# EAGLE design trig3_board_de0-nano (EAGLE 9.6.2)
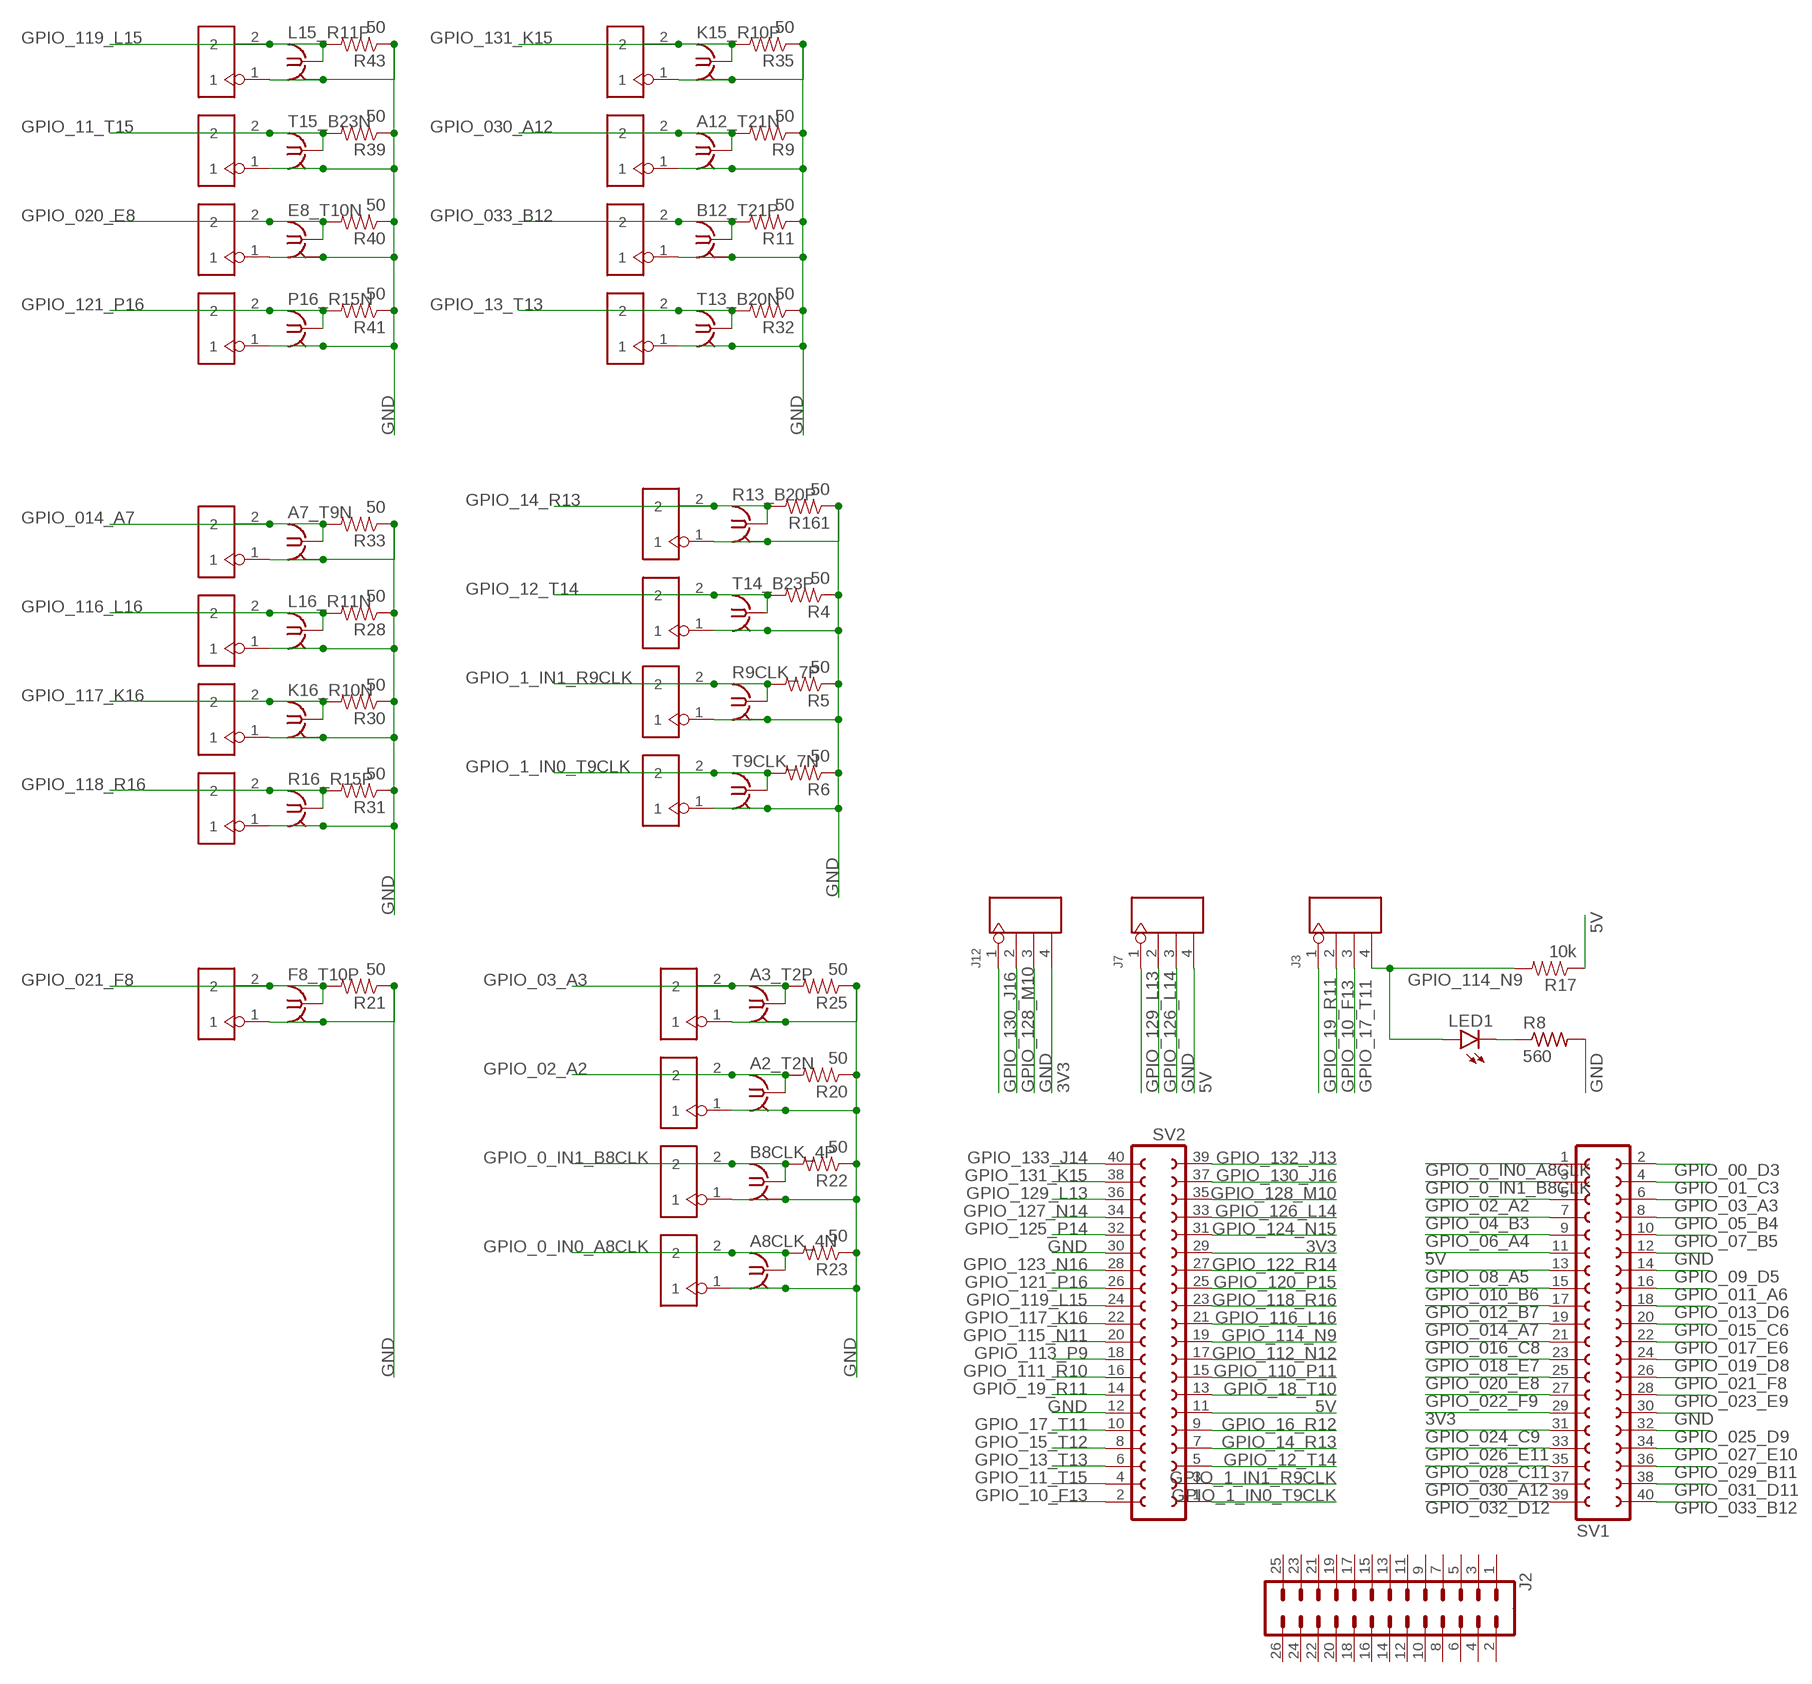
[diagram p0: schematic, sheet 1, part 1 of 2]
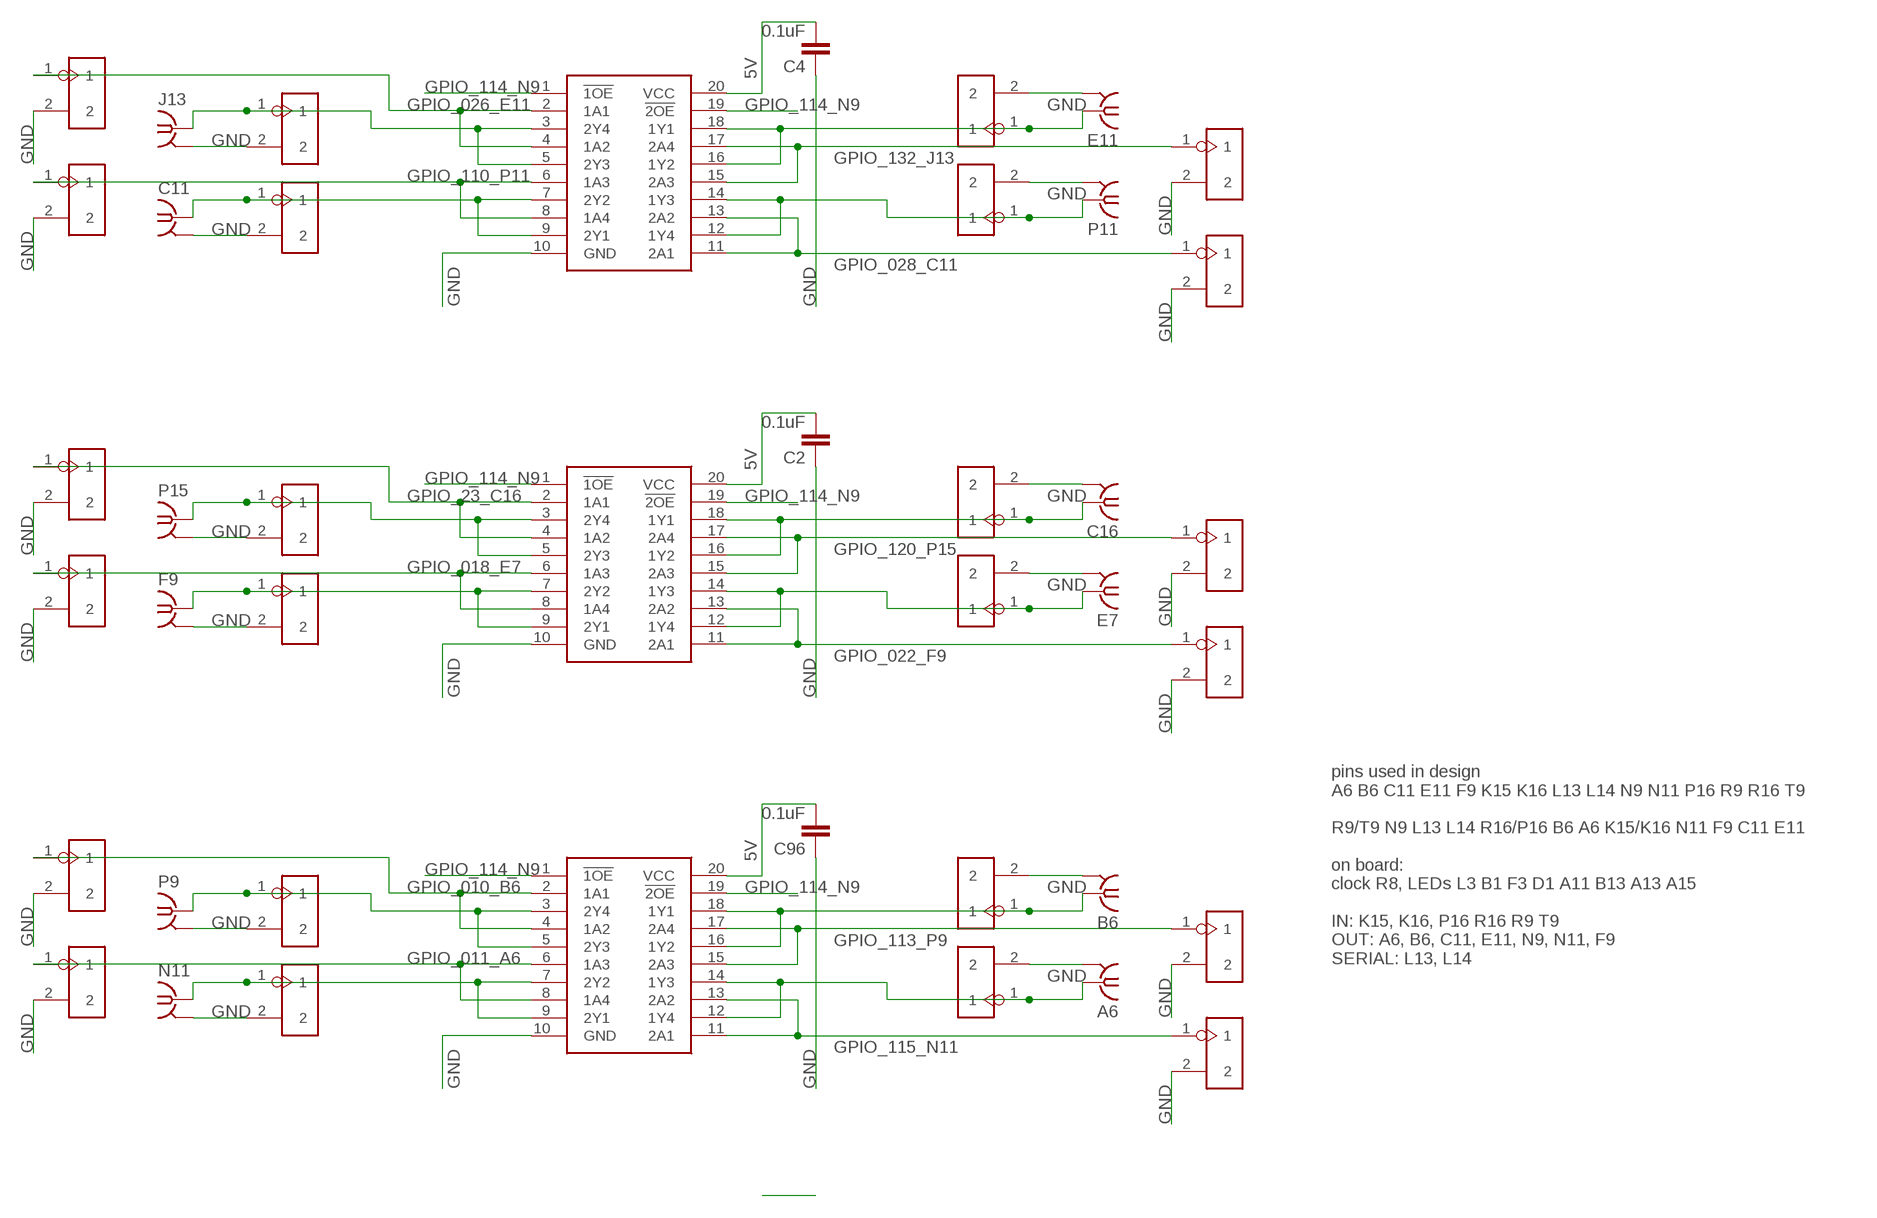
[diagram p1: schematic, sheet 1, part 2 of 2]

## Parts
A2_T2N  BU-SMB-V  [BU-SMB-V]
A3_T2P  BU-SMB-V  [BU-SMB-V]
A6  BU-SMB-V  [BU-SMB-V]
A7_T9N  BU-SMB-V  [BU-SMB-V]
A8CLK_4N  BU-SMB-V  [BU-SMB-V]
A12_T21N  BU-SMB-V  [BU-SMB-V]
B6  BU-SMB-V  [BU-SMB-V]
B8CLK_4P  BU-SMB-V  [BU-SMB-V]
B12_T21P  BU-SMB-V  [BU-SMB-V]
C2  0.1uF  CAP0805  [0805]
C4  0.1uF  CAP0805  [0805]
C11  BU-SMB-V  [BU-SMB-V]
C16  BU-SMB-V  [BU-SMB-V]
C96  0.1uF  CAP0805  [0805]
E7  BU-SMB-V  [BU-SMB-V]
E8_T10N  BU-SMB-V  [BU-SMB-V]
E11  BU-SMB-V  [BU-SMB-V]
F8_T10P  BU-SMB-V  [BU-SMB-V]
F9  BU-SMB-V  [BU-SMB-V]
J2  M13X22X13  [2X13]
J3  4p-2.54  DIP-BLACK-FEMALE-HEADER-VERT(4P-2.54)  [H4-2.54]
J4  2p-2.54  DIP-BLACK-MALE-HEADER-VERT(2P-2.54)  [H2-2.54]
J5  2p-2.54  DIP-BLACK-MALE-HEADER-VERT(2P-2.54)  [H2-2.54]
J6  2p-2.54  DIP-BLACK-MALE-HEADER-VERT(2P-2.54)  [H2-2.54]
J7  4p-2.54  DIP-BLACK-FEMALE-HEADER-VERT(4P-2.54)  [H4-2.54]
J12  4p-2.54  DIP-BLACK-FEMALE-HEADER-VERT(4P-2.54)  [H4-2.54]
J13  BU-SMB-V  [BU-SMB-V]
J17  2p-2.54  DIP-BLACK-MALE-HEADER-VERT(2P-2.54)  [H2-2.54]
J18  2p-2.54  DIP-BLACK-MALE-HEADER-VERT(2P-2.54)  [H2-2.54]
J22  2p-2.54  DIP-BLACK-MALE-HEADER-VERT(2P-2.54)  [H2-2.54]
J23  2p-2.54  DIP-BLACK-MALE-HEADER-VERT(2P-2.54)  [H2-2.54]
J24  2p-2.54  DIP-BLACK-MALE-HEADER-VERT(2P-2.54)  [H2-2.54]
J25  2p-2.54  DIP-BLACK-MALE-HEADER-VERT(2P-2.54)  [H2-2.54]
J32  2p-2.54  DIP-BLACK-MALE-HEADER-VERT(2P-2.54)  [H2-2.54]
J33  2p-2.54  DIP-BLACK-MALE-HEADER-VERT(2P-2.54)  [H2-2.54]
J34  2p-2.54  DIP-BLACK-MALE-HEADER-VERT(2P-2.54)  [H2-2.54]
J35  2p-2.54  DIP-BLACK-MALE-HEADER-VERT(2P-2.54)  [H2-2.54]
J36  2p-2.54  DIP-BLACK-MALE-HEADER-VERT(2P-2.54)  [H2-2.54]
J37  2p-2.54  DIP-BLACK-MALE-HEADER-VERT(2P-2.54)  [H2-2.54]
J38  2p-2.54  DIP-BLACK-MALE-HEADER-VERT(2P-2.54)  [H2-2.54]
J39  2p-2.54  DIP-BLACK-MALE-HEADER-VERT(2P-2.54)  [H2-2.54]
J40  2p-2.54  DIP-BLACK-MALE-HEADER-VERT(2P-2.54)  [H2-2.54]
J41  2p-2.54  DIP-BLACK-MALE-HEADER-VERT(2P-2.54)  [H2-2.54]
J42  2p-2.54  DIP-BLACK-MALE-HEADER-VERT(2P-2.54)  [H2-2.54]
J43  2p-2.54  DIP-BLACK-MALE-HEADER-VERT(2P-2.54)  [H2-2.54]
K15_R10P  BU-SMB-V  [BU-SMB-V]
K16_R10N  BU-SMB-V  [BU-SMB-V]
L15_R11P  BU-SMB-V  [BU-SMB-V]
L16_R11N  BU-SMB-V  [BU-SMB-V]
LED1  red  LEDCHIP-LED0805  [CHIP-LED0805]
N11  BU-SMB-V  [BU-SMB-V]
OJ41  2p-2.54  DIP-BLACK-MALE-HEADER-VERT(2P-2.54)  [H2-2.54]
OJ42  2p-2.54  DIP-BLACK-MALE-HEADER-VERT(2P-2.54)  [H2-2.54]
OJ43  2p-2.54  DIP-BLACK-MALE-HEADER-VERT(2P-2.54)  [H2-2.54]
OJ44  2p-2.54  DIP-BLACK-MALE-HEADER-VERT(2P-2.54)  [H2-2.54]
OJ45  2p-2.54  DIP-BLACK-MALE-HEADER-VERT(2P-2.54)  [H2-2.54]
OJ46  2p-2.54  DIP-BLACK-MALE-HEADER-VERT(2P-2.54)  [H2-2.54]
OJ47  2p-2.54  DIP-BLACK-MALE-HEADER-VERT(2P-2.54)  [H2-2.54]
OJ48  2p-2.54  DIP-BLACK-MALE-HEADER-VERT(2P-2.54)  [H2-2.54]
OJ57  2p-2.54  DIP-BLACK-MALE-HEADER-VERT(2P-2.54)  [H2-2.54]
OJ58  2p-2.54  DIP-BLACK-MALE-HEADER-VERT(2P-2.54)  [H2-2.54]
OJ59  2p-2.54  DIP-BLACK-MALE-HEADER-VERT(2P-2.54)  [H2-2.54]
OJ60  2p-2.54  DIP-BLACK-MALE-HEADER-VERT(2P-2.54)  [H2-2.54]
OJ61  2p-2.54  DIP-BLACK-MALE-HEADER-VERT(2P-2.54)  [H2-2.54]
OJ62  2p-2.54  DIP-BLACK-MALE-HEADER-VERT(2P-2.54)  [H2-2.54]
OJ63  2p-2.54  DIP-BLACK-MALE-HEADER-VERT(2P-2.54)  [H2-2.54]
OJ64  2p-2.54  DIP-BLACK-MALE-HEADER-VERT(2P-2.54)  [H2-2.54]
OJ73  2p-2.54  DIP-BLACK-MALE-HEADER-VERT(2P-2.54)  [H2-2.54]
OJ74  2p-2.54  DIP-BLACK-MALE-HEADER-VERT(2P-2.54)  [H2-2.54]
OJ75  2p-2.54  DIP-BLACK-MALE-HEADER-VERT(2P-2.54)  [H2-2.54]
OJ76  2p-2.54  DIP-BLACK-MALE-HEADER-VERT(2P-2.54)  [H2-2.54]
OJ77  2p-2.54  DIP-BLACK-MALE-HEADER-VERT(2P-2.54)  [H2-2.54]
OJ78  2p-2.54  DIP-BLACK-MALE-HEADER-VERT(2P-2.54)  [H2-2.54]
OJ79  2p-2.54  DIP-BLACK-MALE-HEADER-VERT(2P-2.54)  [H2-2.54]
OJ80  2p-2.54  DIP-BLACK-MALE-HEADER-VERT(2P-2.54)  [H2-2.54]
P9  BU-SMB-V  [BU-SMB-V]
P11  BU-SMB-V  [BU-SMB-V]
P15  BU-SMB-V  [BU-SMB-V]
P16_R15N  BU-SMB-V  [BU-SMB-V]
R4  50  RESISTORAXIAL-0.3  [AXIAL-0.3]
R5  50  RESISTORAXIAL-0.3  [AXIAL-0.3]
R6  50  RESISTORAXIAL-0.3  [AXIAL-0.3]
R8  560  R-US_R0805  [R0805]
R9  50  RESISTORAXIAL-0.3  [AXIAL-0.3]
R9CLK_7P  BU-SMB-V  [BU-SMB-V]
R11  50  RESISTORAXIAL-0.3  [AXIAL-0.3]
R13_B20P  BU-SMB-V  [BU-SMB-V]
R16_R15P  BU-SMB-V  [BU-SMB-V]
R17  10k  RESISTORAXIAL-0.3  [AXIAL-0.3]
R20  50  RESISTORAXIAL-0.3  [AXIAL-0.3]
R21  50  RESISTORAXIAL-0.3  [AXIAL-0.3]
R22  50  RESISTORAXIAL-0.3  [AXIAL-0.3]
R23  50  RESISTORAXIAL-0.3  [AXIAL-0.3]
R25  50  RESISTORAXIAL-0.3  [AXIAL-0.3]
R28  50  RESISTORAXIAL-0.3  [AXIAL-0.3]
R30  50  RESISTORAXIAL-0.3  [AXIAL-0.3]
R31  50  RESISTORAXIAL-0.3  [AXIAL-0.3]
R32  50  RESISTORAXIAL-0.3  [AXIAL-0.3]
R33  50  RESISTORAXIAL-0.3  [AXIAL-0.3]
R35  50  RESISTORAXIAL-0.3  [AXIAL-0.3]
R39  50  RESISTORAXIAL-0.3  [AXIAL-0.3]
R40  50  RESISTORAXIAL-0.3  [AXIAL-0.3]
R41  50  RESISTORAXIAL-0.3  [AXIAL-0.3]
R43  50  RESISTORAXIAL-0.3  [AXIAL-0.3]
R161  50  RESISTORAXIAL-0.3  [AXIAL-0.3]
SV1  FE20-2  [FE20-2]
SV2  FE20-2  [FE20-2]
T9CLK_7N  BU-SMB-V  [BU-SMB-V]
T13_B20N  BU-SMB-V  [BU-SMB-V]
T14_B23P  BU-SMB-V  [BU-SMB-V]
T15_B23N  BU-SMB-V  [BU-SMB-V]
VSLUE5  SN74ACT244DW  [SOIC127P1030X265-20N]
VSLUE7  SN74ACT244DW  [SOIC127P1030X265-20N]
VSLUE9  SN74ACT244DW  [SOIC127P1030X265-20N]

## Nets
3V3 [power]: J12.4 SV1.29 SV2.29
5V [power]: C2.2 C4.2 C96.2 J7.4 R17.P$1 SV1.11 SV2.11 VSLUE5.20(VCC) VSLUE7.20(VCC) VSLUE9.20(VCC)
GND: A2_T2N.2 A2_T2N.3 A2_T2N.4 A2_T2N.5 A3_T2P.2 A3_T2P.3 A3_T2P.4 A3_T2P.5 A6.2 A6.3 A6.4 A6.5 A7_T9N.2 A7_T9N.3 A7_T9N.4 A7_T9N.5 A8CLK_4N.2 A8CLK_4N.3 A8CLK_4N.4 A8CLK_4N.5 A12_T21N.2 A12_T21N.3 A12_T21N.4 A12_T21N.5 B6.2 B6.3 B6.4 B6.5 B8CLK_4P.2 B8CLK_4P.3 B8CLK_4P.4 B8CLK_4P.5 B12_T21P.2 B12_T21P.3 B12_T21P.4 B12_T21P.5 C2.1 C4.1 C11.2 C11.3 C11.4 C11.5 C16.2 C16.3 C16.4 C16.5 C96.1 E7.2 E7.3 E7.4 E7.5 E8_T10N.2 E8_T10N.3 E8_T10N.4 E8_T10N.5 E11.2 E11.3 E11.4 E11.5 F8_T10P.2 F8_T10P.3 F8_T10P.4 F8_T10P.5 F9.2 F9.3 F9.4 F9.5 J4.1 J5.1 J6.1 J7.3 J12.3 J13.2 J13.3 J13.4 J13.5 J17.1 J18.1 J22.1 J23.1 J24.1 J25.1 J32.1 J33.1 J34.1 J35.1 J36.1 J37.1 J38.1 J39.1 J40.1 J41.1 J42.1 J43.1 K15_R10P.2 K15_R10P.3 K15_R10P.4 K15_R10P.5 K16_R10N.2 K16_R10N.3 K16_R10N.4 K16_R10N.5 L15_R11P.2 L15_R11P.3 L15_R11P.4 L15_R11P.5 L16_R11N.2 L16_R11N.3 L16_R11N.4 L16_R11N.5 N11.2 N11.3 N11.4 N11.5 OJ41.2 OJ42.2 OJ43.2 OJ44.2 OJ45.2 OJ46.2 OJ47.2 OJ48.2 OJ57.2 OJ58.2 OJ59.2 OJ60.2 OJ61.2 OJ62.2 OJ63.2 OJ64.2 OJ73.2 OJ74.2 OJ75.2 OJ76.2 OJ77.2 OJ78.2 OJ79.2 OJ80.2 P9.2 P9.3 P9.4 P9.5 P11.2 P11.3 P11.4 P11.5 P15.2 P15.3 P15.4 P15.5 P16_R15N.2 P16_R15N.3 P16_R15N.4 P16_R15N.5 R4.P$1 R5.P$1 R6.P$1 R8.2 R9.P$1 R9CLK_7P.2 R9CLK_7P.3 R9CLK_7P.4 R9CLK_7P.5 R11.P$1 R13_B20P.2 R13_B20P.3 R13_B20P.4 R13_B20P.5 R16_R15P.2 R16_R15P.3 R16_R15P.4 R16_R15P.5 R20.P$1 R21.P$1 R22.P$1 R23.P$1 R25.P$1 R28.P$1 R30.P$1 R31.P$1 R32.P$1 R33.P$1 R35.P$1 R39.P$1 R40.P$1 R41.P$1 R43.P$1 R161.P$1 SV1.12 SV1.30 SV2.12 SV2.30 T9CLK_7N.2 T9CLK_7N.3 T9CLK_7N.4 T9CLK_7N.5 T13_B20N.2 T13_B20N.3 T13_B20N.4 T13_B20N.5 T14_B23P.2 T14_B23P.3 T14_B23P.4 T14_B23P.5 T15_B23N.2 T15_B23N.3 T15_B23N.4 T15_B23N.5 VSLUE5.10(GND) VSLUE7.10(GND) VSLUE9.10(GND)
GPIO_00_D3: SV1.2
GPIO_0_IN0_A8CLK: A8CLK_4N.1 J24.2 R23.P$2 SV1.1
GPIO_0_IN1_B8CLK: B8CLK_4P.1 J23.2 R22.P$2 SV1.3
GPIO_01_C3: SV1.4
GPIO_1_IN0_T9CLK: J6.2 R6.P$2 SV2.1 T9CLK_7N.1
GPIO_1_IN1_R9CLK: J5.2 R5.P$2 R9CLK_7P.1 SV2.3
GPIO_02_A2: A2_T2N.1 J22.2 R20.P$2 SV1.5
GPIO_03_A3: A3_T2P.1 J25.2 R25.P$2 SV1.6
GPIO_04_B3: SV1.7
GPIO_05_B4: SV1.8
GPIO_06_A4: SV1.9
GPIO_07_B5: SV1.10
GPIO_08_A5: SV1.13
GPIO_09_D5: SV1.14
GPIO_010_B6: OJ47.1 SV1.15 VSLUE5.2(1A1) VSLUE5.4(1A2)
GPIO_10_F13: J3.2 SV2.2
GPIO_011_A6: OJ48.1 SV1.16 VSLUE5.6(1A3) VSLUE5.8(1A4)
GPIO_11_T15: J40.2 R39.P$2 SV2.4 T15_B23N.1
GPIO_012_B7: SV1.17
GPIO_12_T14: J4.2 R4.P$2 SV2.5 T14_B23P.1
GPIO_013_D6: SV1.18
GPIO_13_T13: J38.2 R32.P$2 SV2.6 T13_B20N.1
GPIO_014_A7: A7_T9N.1 J35.2 R33.P$2 SV1.19
GPIO_14_R13: J17.2 R13_B20P.1 R161.P$2 SV2.7
GPIO_015_C6: SV1.20
GPIO_15_T12: SV2.8
GPIO_016_C8: SV1.21
GPIO_16_R12: SV2.9
GPIO_017_E6: SV1.22
GPIO_17_T11: J3.3 SV2.10
GPIO_018_E7: OJ64.1 SV1.23 VSLUE7.6(1A3) VSLUE7.8(1A4)
GPIO_18_T10: SV2.13
GPIO_019_D8: SV1.24
GPIO_19_R11: J3.1 SV2.14
GPIO_020_E8: E8_T10N.1 J41.2 R40.P$2 SV1.25
GPIO_021_F8: F8_T10P.1 J18.2 R21.P$2 SV1.26
GPIO_022_F9: OJ62.1 SV1.27 VSLUE7.11(2A1) VSLUE7.13(2A2)
GPIO_23_C16: OJ63.1 VSLUE7.2(1A1) VSLUE7.4(1A2)
GPIO_023_E9: SV1.28
GPIO_024_C9: SV1.31
GPIO_025_D9: SV1.32
GPIO_026_E11: OJ79.1 SV1.33 VSLUE9.2(1A1) VSLUE9.4(1A2)
GPIO_027_E10: SV1.34
GPIO_028_C11: OJ78.1 SV1.35 VSLUE9.11(2A1) VSLUE9.13(2A2)
GPIO_029_B11: SV1.36
GPIO_030_A12: A12_T21N.1 J36.2 R9.P$2 SV1.37
GPIO_031_D11: SV1.38
GPIO_032_D12: SV1.39
GPIO_033_B12: B12_T21P.1 J37.2 R11.P$2 SV1.40
GPIO_110_P11: OJ80.1 SV2.15 VSLUE9.6(1A3) VSLUE9.8(1A4)
GPIO_111_R10: SV2.16
GPIO_112_N12: SV2.17
GPIO_113_P9: OJ45.1 SV2.18 VSLUE5.15(2A3) VSLUE5.17(2A4)
GPIO_114_N9: J3.4 LED1.A R17.P$2 SV2.19 VSLUE5.1(!1OE) VSLUE5.19(!2OE) VSLUE7.1(!1OE) VSLUE7.19(!2OE) VSLUE9.1(!1OE) VSLUE9.19(!2OE)
GPIO_115_N11: OJ46.1 SV2.20 VSLUE5.11(2A1) VSLUE5.13(2A2)
GPIO_116_L16: J32.2 L16_R11N.1 R28.P$2 SV2.21
GPIO_117_K16: J33.2 K16_R10N.1 R30.P$2 SV2.22
GPIO_118_R16: J34.2 R16_R15P.1 R31.P$2 SV2.23
GPIO_119_L15: J43.2 L15_R11P.1 R43.P$2 SV2.24
GPIO_120_P15: OJ61.1 SV2.25 VSLUE7.15(2A3) VSLUE7.17(2A4)
GPIO_121_P16: J42.2 P16_R15N.1 R41.P$2 SV2.26
GPIO_122_R14: SV2.27
GPIO_123_N16: SV2.28
GPIO_124_N15: SV2.31
GPIO_125_P14: SV2.32
GPIO_126_L14: J7.2 SV2.33
GPIO_127_N14: SV2.34
GPIO_128_M10: J12.2 SV2.35
GPIO_129_L13: J7.1 SV2.36
GPIO_130_J16: J12.1 SV2.37
GPIO_131_K15: J39.2 K15_R10P.1 R35.P$2 SV2.38
GPIO_132_J13: OJ77.1 SV2.39 VSLUE9.15(2A3) VSLUE9.17(2A4)
GPIO_133_J14: SV2.40
N$9: LED1.C R8.1
OUT21: B6.1 OJ44.1 VSLUE5.16(1Y2) VSLUE5.18(1Y1)
OUT22: A6.1 OJ43.1 VSLUE5.12(1Y4) VSLUE5.14(1Y3)
OUT23: OJ41.1 P9.1 VSLUE5.3(2Y4) VSLUE5.5(2Y3)
OUT24: N11.1 OJ42.1 VSLUE5.7(2Y2) VSLUE5.9(2Y1)
OUT29: C16.1 OJ60.1 VSLUE7.16(1Y2) VSLUE7.18(1Y1)
OUT30: E7.1 OJ59.1 VSLUE7.12(1Y4) VSLUE7.14(1Y3)
OUT31: OJ57.1 P15.1 VSLUE7.3(2Y4) VSLUE7.5(2Y3)
OUT32: F9.1 OJ58.1 VSLUE7.7(2Y2) VSLUE7.9(2Y1)
OUT37: E11.1 OJ76.1 VSLUE9.16(1Y2) VSLUE9.18(1Y1)
OUT38: OJ75.1 P11.1 VSLUE9.12(1Y4) VSLUE9.14(1Y3)
OUT39: J13.1 OJ73.1 VSLUE9.3(2Y4) VSLUE9.5(2Y3)
OUT40: C11.1 OJ74.1 VSLUE9.7(2Y2) VSLUE9.9(2Y1)
Unconnected: J2.1 J2.2 J2.3 J2.4 J2.5 J2.6 J2.7 J2.8 J2.9 J2.10 J2.11 J2.12 J2.13 J2.14 J2.15 J2.16 J2.17 J2.18 J2.19 J2.20 J2.21 J2.22 J2.23 J2.24 J2.25 J2.26

## Notes on the sheet
- pins used in design
  A6 B6 C11 E11 F9 K15 K16 L13 L14 N9 N11 P16 R9 R16 T9
  
  R9/T9 N9 L13 L14 R16/P16 B6 A6 K15/K16 N11 F9 C11 E11 
  
  on board:
  clock R8, LEDs L3 B1 F3 D1 A11 B13 A13 A15 
  
  IN: K15, K16, P16 R16 R9 T9
  OUT: A6, B6, C11, E11, N9, N11, F9
  SERIAL: L13, L14

## Library data of the parts
A2_T2N A3_T2P A6 A7_T9N A8CLK_4N A12_T21N B6 B8CLK_4P B12_T21P C11 C16 E7 E8_T10N E11 F8_T10P F9 J13 K15_R10P K16_R10N L15_R11P L16_R11N N11 P9 P11 P15 P16_R15N R9CLK_7P R13_B20P R16_R15P T9CLK_7N T13_B20N T14_B23P T15_B23N = con-coax:BU-SMB-V: FEMALE SMB CONNECTOR Radiall distributor RS 112-2993; OC_FARNELL: unknown; OC_NEWARK: unknown
C2 C4 C96 = SparkFun-Capacitors:CAP: Capacitor Standard 0603 ceramic capacitor, and 0.1" leaded capacitor.
J2 = SparkFun-Connectors:M13X2: 0.1" spaced headers
J3 J7 J12 = Seeed-Connector:DIP-BLACK-FEMALE-HEADER-VERT(4P-2.54): 320030017; MPN: F185-1104A1BSYA1
J4-J6 J17 J18 J22-J25 J32-J43 OJ41-OJ48 OJ57-OJ64 OJ73-OJ80 = Seeed-Connector:DIP-BLACK-MALE-HEADER-VERT(2P-2.54): 320020016; MPN: P125-1102A0BS116A1
LED1 = led:LED: LED OSRAM: - CHIPLED LG R971, LG N971, LY N971, LG Q971, LY Q971, LO R971, LY R971 LH N974, LH R974 LS Q976, LO Q976, LY Q976 LO Q996 - Hyper CHIPLED LW Q18S LB Q993, LB Q99A, LB R99A - SideLED LS A670, LO A670, LY A670, LG A670, LP A670 LB A673, LV A673, LT A673, LW A673 LH A674 LY A675 LS A676, LA A676, LO A676, LY A676, LW A676 LS A679, LY A679, LG A679 - Hyper Micro SIDELED® LS Y876, LA Y876, LO Y876, LY Y876 LT Y87S - SmartLED LW L88C, LW L88S LB L89C, LB L89S, LG L890 LS L89K, LO L89K, LY L89K LS L896, LA L896, LO L896, LY L896 - TOPLED LS T670, LO T670, LY T670, LG T670, LP T670 LSG T670, LSP T670, LSY T670, LOP T670, LYG T670 LG T671, LOG T671, LSG T671 LB T673, LV T673, LT T673, LW T673 LH T674 LS T676, LA T676, LO T676, LY T676, LB T676, LH T676, LSB T676, LW T676 LB T67C, LV T67C, LT T67C, LS T67K, LO T67K, LY T67K, LW E67C LS E67B, LA E67B, LO E67B, LY E67B, LB E67C, LV E67C, LT E67C LW T67C LS T679, LY T679, LG T679 LS T770, LO T770, LY T770, LG T770, LP T770 LB T773, LV T773, LT T773, LW T773 LH T774 LS E675, LA E675, LY E675, LS T675 LS T776, LA T776, LO T776, LY T776, LB T776 LHGB T686 LT T68C, LB T68C - Hyper Mini TOPLED® LB M676 - Mini TOPLED Santana® LG M470 LS M47K, LO M47K, LY M47K Source: http://www.osram.convergy.de LUXEON: - LUMILED® LXK2-PW12-R00, LXK2-PW12-S00, LXK2-PW14-U00, LXK2-PW14-V00 LXK2-PM12-R00, LXK2-PM12-S00, LXK2-PM14-U00 LXK2-PE12-Q00, LXK2-PE12-R00, LXK2-PE12-S00, LXK2-PE14-T00, LXK2-PE14-U00 LXK2-PB12-K00, LXK2-PB12-L00, LXK2-PB12-M00, LXK2-PB14-N00, LXK2-PB14-P00, LXK2-PB14-Q00 LXK2-PR12-L00, LXK2-PR12-M00, LXK2-PR14-Q00, LXK2-PR14-R00 LXK2-PD12-Q00, LXK2-PD12-R00, LXK2-PD12-S00 LXK2-PH12-R00, LXK2-PH12-S00 LXK2-PL12-P00, LXK2-PL12-Q00, LXK2-PL12-R00 Source: www.luxeon.com KINGBRIGHT: KA-3528ASYC Source: www.kingbright.com
R4-R6 R9 R11 R17 R20-R23 R25 R28 R30-R33 R35 R39-R41 R43 R161 = SparkFun-Passives:RESISTOR: Resistor Basic schematic elements and footprints for 0603, 1206, and PTH resistors.
R8 = resistor:R-US_: RESISTOR, American symbol
SV1 SV2 = con-lsta:FE20-2: FEMALE HEADER; OC_FARNELL: unknown; OC_NEWARK: unknown
VSLUE5 VSLUE7 VSLUE9 = SN74ACT244DW:SN74ACT244DW: SN74ACT244DW, 8-Bit Buffer, Line Driver, ACT, 3-State Non-Inverting 4.5 5.5 V 20-Pin SOIC Source: Datasheet <http://www.ti.com/lit/ds/symlink/sn74act244.pdf>; ARROW_PART_NUMBER: SN74ACT244DW; ARROW_PRICE-STOCK: https://www.arrow.com/en/products/sn74act244dw/texas-instruments; DESCRIPTION: SN74ACT244DW, 8-Bit Buffer, Line Driver, ACT, 3-State Non-Inverting 4.5 5.5 V 20-Pin SOIC; HEIGHT: 2.65mm; MANUFACTURER_NAME: Texas Instruments; MANUFACTURER_PART_NUMBER: SN74ACT244DW; RS_PART_NUMBER: 4363169; RS_PRICE-STOCK: http://uk.rs-online.com/web/p/products/4363169

## Net classes
0 default: width 0.254 mm
1 power: width 0.762 mm

## Board
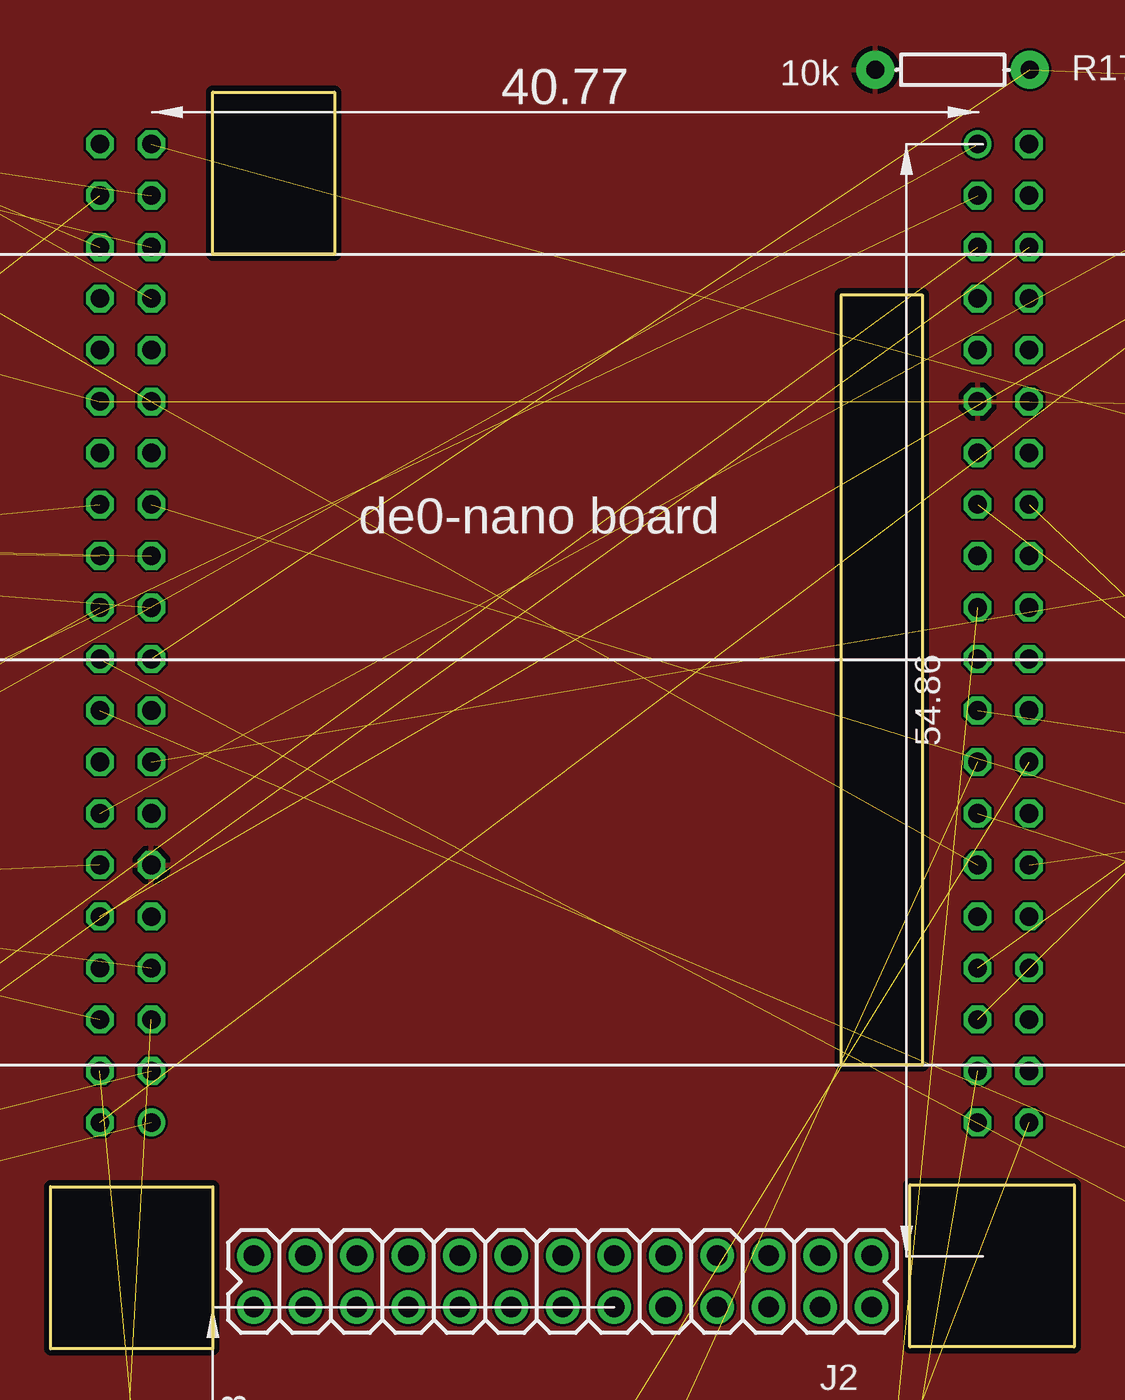
[diagram p2: board, top side]
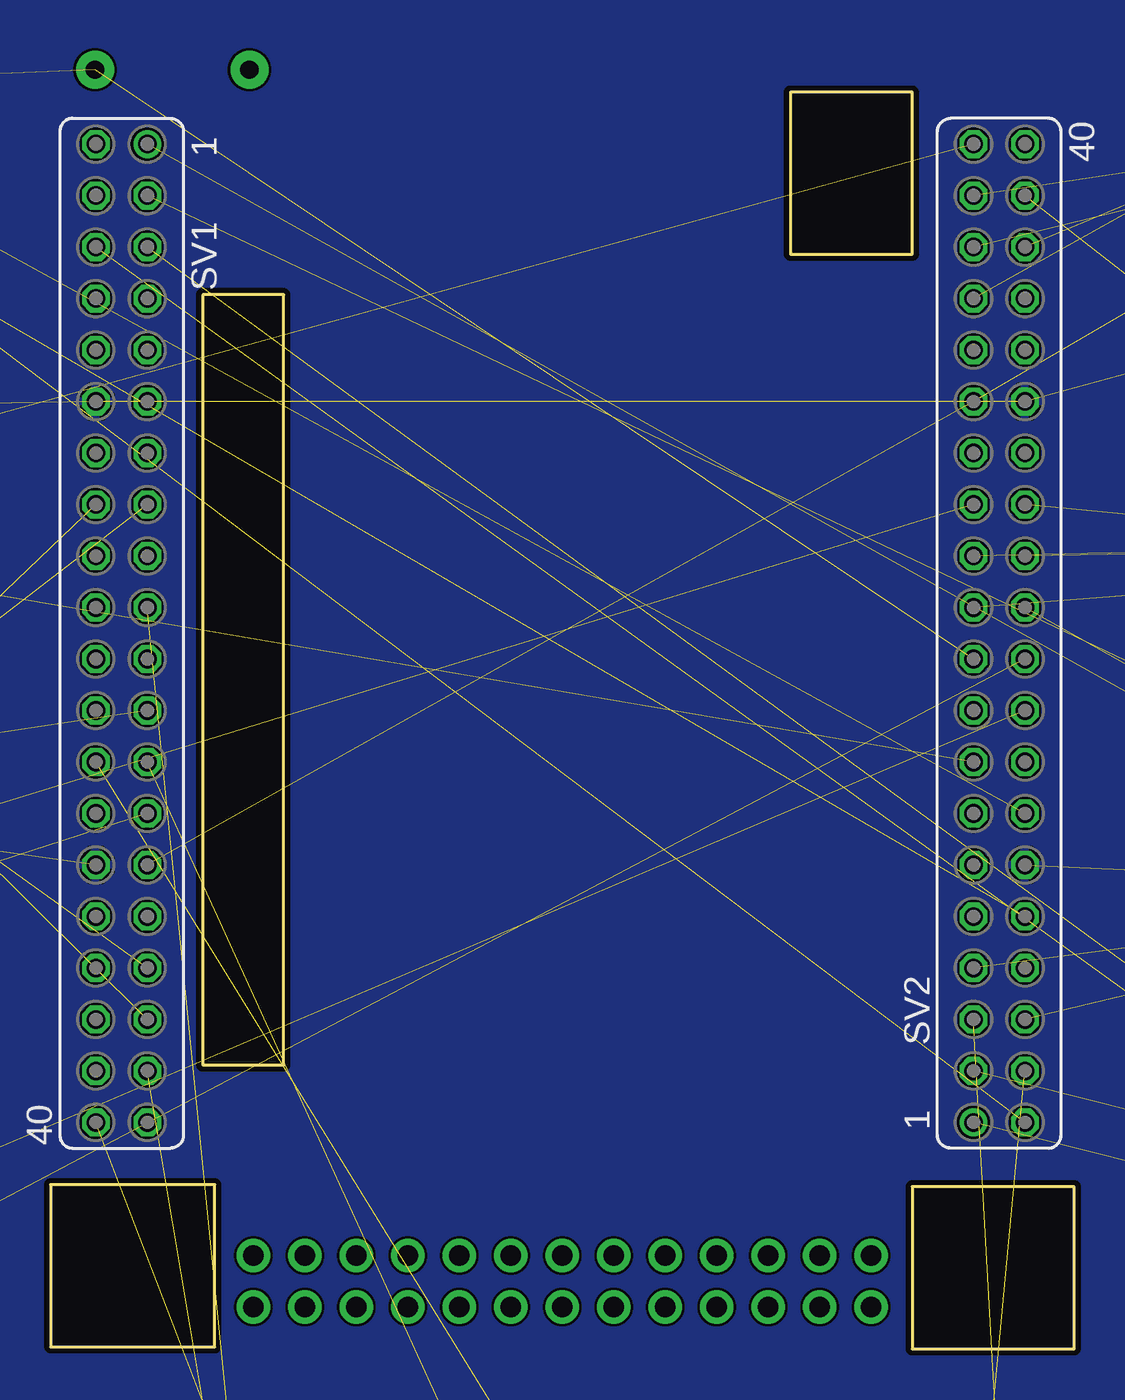
[diagram p3: board, bottom side, seen from below]

Size 50.5 x 62 mm. Coordinates in mm from the lower left corner, seen from the top.
Outline: 50.5,8.1 50.5,0.1 42.4,0.1 42.4,8.1 50.5,8.1
Outline: 8,8 8,0 0,0 0,8 8,8
Outline: 43,52 43,14 39,14 39,52 43,52
Outline: 8,54 8,62 14,62 14,54 8,54
Copper layers (1*2*15*16): Top 0.035mm / dielectric 0.23mm / Route2 0.035mm / dielectric 0.93mm / Route15 0.035mm / dielectric 0.23mm / Bottom 0.035mm
Design rules "MF_Standard_4_Layer": minimum track width 5mil, minimum drill 12mil, track to track 5mil, track to pad 5mil, pad to pad 5mil, via to via 5mil, smd to smd 0mil, copper to edge 10mil, drill to drill 10mil, minimum pad ring 6mil, minimum via ring 6mil, stop-mask expansion 2mil, vias tented up to drill 25mil, thermal gap 10mil
Holes 2.9 mm at -48.6,-92.4 84.8,-92.5 173.6,-92.4 40.3,-92.4 -48.5,61 173.5,61

### Footprints (pad centres in the part's own frame; a part is rotated, then mirrored left to right if it is on the bottom)
BU-SMB-V = drill 1.4: 1 0,0; 2 -2.54,2.54; 3 2.54,2.54; 4 2.54,-2.54; 5 -2.54,-2.54
0805 = smd 0.8 x 1.2: 1 -0.9,0; 2 0.9,0
2X13 = drill 1.016 pad 1.651: 1 0,0; 2 0,2.54; 3 2.54,0; 4 2.54,2.54; 5 5.08,0; 6 5.08,2.54; 7 7.62,0; 8 7.62,2.54; 9 10.16,0; 10 10.16,2.54; 11 12.7,0; 12 12.7,2.54; 13 15.24,0; 14 15.24,2.54; 15 17.78,0; 16 17.78,2.54; 17 20.32,0; 18 20.32,2.54; 19 22.86,0; 20 22.86,2.54; 21 25.4,0; 22 25.4,2.54; 23 27.94,0; 24 27.94,2.54; 25 30.48,0; 26 30.48,2.54
H4-2.54 = drill 0.889 pad 1.651 square: 1 0,3.81 | drill 0.889 pad 1.651: 2 0,1.27; 3 0,-1.27; 4 0,-3.81
H2-2.54 = drill 0.889 pad 1.651 square: 1 0,1.27 | drill 0.889 pad 1.651: 2 0,-1.27
CHIP-LED0805 = smd 1.2 x 1.2: A 0,-1.05; C 0,1.05
AXIAL-0.3 = drill 0.9 pad 1.88: P$1 -3.81,0; P$2 3.81,0
R0805 = smd 1.3 x 1.5: 1 -0.95,0; 2 0.95,0
FE20-2 = drill 0.914: 1 -24.13,1.27 | drill 0.914 octagon: 2 -24.13,-1.27; 3 -21.59,1.27; 4 -21.59,-1.27; 5 -19.05,1.27; 6 -19.05,-1.27; 7 -16.51,1.27; 8 -16.51,-1.27; 9 -13.97,1.27; 10 -13.97,-1.27; 11 -11.43,1.27; 12 -11.43,-1.27; 13 -8.89,1.27; 14 -8.89,-1.27; 15 -6.35,1.27; 16 -6.35,-1.27; 17 -3.81,1.27; 18 -3.81,-1.27; 19 -1.27,1.27; 20 -1.27,-1.27; 21 1.27,1.27; 22 1.27,-1.27; 23 3.81,1.27; 24 3.81,-1.27; 25 6.35,1.27; 26 6.35,-1.27; 27 8.89,1.27; 28 8.89,-1.27; 29 11.43,1.27; 30 11.43,-1.27; 31 13.97,1.27; 32 13.97,-1.27; 33 16.51,1.27; 34 16.51,-1.27; 35 19.05,1.27; 36 19.05,-1.27; 37 21.59,1.27; 38 21.59,-1.27; 39 24.13,1.27; 40 24.13,-1.27
SOIC127P1030X265-20N = smd 1.95 x 0.65: 1 -4.725,5.715; 2 -4.725,4.445; 3 -4.725,3.175; 4 -4.725,1.905; 5 -4.725,0.635; 6 -4.725,-0.635; 7 -4.725,-1.905; 8 -4.725,-3.175; 9 -4.725,-4.445; 10 -4.725,-5.715; 11 4.725,-5.715; 12 4.725,-4.445; 13 4.725,-3.175; 14 4.725,-1.905; 15 4.725,-0.635; 16 4.725,0.635; 17 4.725,1.905; 18 4.725,3.175; 19 4.725,4.445; 20 4.725,5.715

### Placement (x,y rotation side)
A2_T2N  -37.02,-14.35 180 top  (outside the outline)
A3_T2P  -46.9,-14.4 180 top  (outside the outline)
A6  103.02,9.05 0 top  (outside the outline)
A7_T9N  39,-74.4 180 top  (outside the outline)
A8CLK_4N  -36.91,5.65 180 top  (outside the outline)
A12_T21N  38.98,-54.35 180 top  (outside the outline)
B6  112.96,9.05 0 top  (outside the outline)
B8CLK_4P  -46.96,5.65 180 top  (outside the outline)
B12_T21P  29.04,-54.35 180 top  (outside the outline)
C2  96,35 270 top  (outside the outline)
C4  96,55 270 top  (outside the outline)
C11  68.93,48.95 180 top  (outside the outline)
C16  112.96,29.05 0 top  (outside the outline)
C96  96,15 270 top  (outside the outline)
E7  103.02,29.05 0 top  (outside the outline)
E8_T10N  14.04,-54.35 180 top  (outside the outline)
E11  112.96,49.05 0 top  (outside the outline)
F8_T10P  4,-54.4 180 top  (outside the outline)
F9  68.93,28.95 180 top  (outside the outline)
J2  40.5,4.6 180 top
J3  71,62 90 top  (outside the outline)
J4  2.95,-80.21 90 top  (outside the outline)
J5  -28,-0.21 90 top  (outside the outline)
J6  -17.95,-0.21 90 top  (outside the outline)
J7  -12,62 90 top  (outside the outline)
J12  -25,62 90 top  (outside the outline)
J13  78.88,48.95 180 top  (outside the outline)
J17  -48,20 90 top  (outside the outline)
J18  3,-60 90 top  (outside the outline)
J22  -38.05,-20.21 90 top  (outside the outline)
J23  -48,-0.21 90 top  (outside the outline)
J24  -37.95,-0.21 90 top  (outside the outline)
J25  -48,-20 90 top  (outside the outline)
J32  -38.05,39.79 90 top  (outside the outline)
J33  -18,19.79 90 top  (outside the outline)
J34  -27.95,39.79 90 top  (outside the outline)
J35  38,-80 90 top  (outside the outline)
J36  37.95,-60.21 90 top  (outside the outline)
J37  28,-60.21 90 top  (outside the outline)
J38  -37.95,19.79 90 top  (outside the outline)
J39  -28,20 90 top  (outside the outline)
J40  12.95,-80.21 90 top  (outside the outline)
J41  13,-60.21 90 top  (outside the outline)
J42  -17.95,39.79 90 top  (outside the outline)
J43  -48,40 90 top  (outside the outline)
K15_R10P  -27,25.6 180 top  (outside the outline)
K16_R10N  -16.96,25.65 180 top  (outside the outline)
L15_R11P  -47.1,45.6 180 top  (outside the outline)
L16_R11N  -37.02,45.65 180 top  (outside the outline)
LED1  91,60 270 top  (outside the outline)
N11  68.93,8.95 180 top  (outside the outline)
OJ41  79.92,3.04 90 top  (outside the outline)
OJ42  69.97,3.04 90 top  (outside the outline)
OJ43  104.02,3.04 90 top  (outside the outline)
OJ44  114.07,3.04 90 top  (outside the outline)
OJ45  80,-1 90 top  (outside the outline)
OJ46  70,-1 90 top  (outside the outline)
OJ47  114,-1 90 top  (outside the outline)
OJ48  104,-1 90 top  (outside the outline)
OJ57  79.92,23.04 90 top  (outside the outline)
OJ58  69.97,23.04 90 top  (outside the outline)
OJ59  104.02,23.04 90 top  (outside the outline)
OJ60  114.07,23.04 90 top  (outside the outline)
OJ61  80,19 90 top  (outside the outline)
OJ62  70,19 90 top  (outside the outline)
OJ63  114,19 90 top  (outside the outline)
OJ64  104,19 90 top  (outside the outline)
OJ73  79.92,43.04 90 top  (outside the outline)
OJ74  69.97,43.04 90 top  (outside the outline)
OJ75  104.02,43.04 90 top  (outside the outline)
OJ76  114.07,43.04 90 top  (outside the outline)
OJ77  80,39 90 top  (outside the outline)
OJ78  70,39 90 top  (outside the outline)
OJ79  114,39 90 top  (outside the outline)
OJ80  104,39 90 top  (outside the outline)
P9  78.88,8.95 180 top  (outside the outline)
P11  103.02,49.05 0 top  (outside the outline)
P15  78.88,28.95 180 top  (outside the outline)
P16_R15N  -16.91,45.65 180 top  (outside the outline)
R4  4,-69 180 top  (outside the outline)
R5  -27,11 180 top  (outside the outline)
R6  -17,11 180 top  (outside the outline)
R8  97,60 0 top  (outside the outline)
R9  39,-49 180 top  (outside the outline)
R9CLK_7P  -26.96,5.65 180 top  (outside the outline)
R11  29,-49 180 top  (outside the outline)
R13_B20P  -46.9,25.6 180 top  (outside the outline)
R16_R15P  -26.91,45.65 180 top  (outside the outline)
R17  44.5,63.1 0 top
R20  -37,-9 180 top  (outside the outline)
R21  4,-49 180 top  (outside the outline)
R22  -47,11 180 top  (outside the outline)
R23  -37,11 180 top  (outside the outline)
R25  -47,-9 180 top  (outside the outline)
R28  -37,51 180 top  (outside the outline)
R30  -17,31 180 top  (outside the outline)
R31  -27,51 180 top  (outside the outline)
R32  -37,31 180 top  (outside the outline)
R33  39,-69 180 top  (outside the outline)
R35  -27,31 180 top  (outside the outline)
R39  14,-69 180 top  (outside the outline)
R40  14,-49 180 top  (outside the outline)
R41  -17,51 180 top  (outside the outline)
R43  -47,51 180 top  (outside the outline)
R161  -47,31 180 top  (outside the outline)
SV1  47,35.3 270 bottom
SV2  3.7,35.3 90 bottom
T9CLK_7N  -16.91,5.65 180 top  (outside the outline)
T13_B20N  -36.91,25.65 180 top  (outside the outline)
T14_B23P  3.98,-74.35 180 top  (outside the outline)
T15_B23N  13.98,-74.35 180 top  (outside the outline)
VSLUE5  91,6 0 top  (outside the outline)
VSLUE7  91,26 0 top  (outside the outline)
VSLUE9  91,46 0 top  (outside the outline)

### Tracks (layer width: path | path; a pad name or v marks a point on that pad's centre or on a via)
3V3  (2 unrouted)
5V
  pour Top: -60,69 189,69 189,-103 -60,-103
GND  (210 unrouted)
  pour Bottom: 183,67 183,-97 -56,-97 -56,67
GPIO_0_IN0_A8CLK  (3 unrouted)
GPIO_0_IN1_B8CLK  (3 unrouted)
GPIO_1_IN0_T9CLK  (3 unrouted)
GPIO_1_IN1_R9CLK  (3 unrouted)
GPIO_02_A2  (3 unrouted)
GPIO_03_A3  (3 unrouted)
GPIO_010_B6  (3 unrouted)
GPIO_10_F13  (1 unrouted)
GPIO_011_A6  (3 unrouted)
GPIO_11_T15  (3 unrouted)
GPIO_12_T14  (3 unrouted)
GPIO_13_T13  (3 unrouted)
GPIO_014_A7  (3 unrouted)
GPIO_14_R13  (3 unrouted)
GPIO_17_T11  (1 unrouted)
GPIO_018_E7  (3 unrouted)
GPIO_19_R11  (1 unrouted)
GPIO_020_E8  (3 unrouted)
GPIO_021_F8  (3 unrouted)
GPIO_022_F9  (3 unrouted)
GPIO_23_C16  (2 unrouted)
GPIO_026_E11  (3 unrouted)
GPIO_028_C11  (3 unrouted)
GPIO_030_A12  (3 unrouted)
GPIO_033_B12  (3 unrouted)
GPIO_110_P11  (3 unrouted)
GPIO_113_P9  (3 unrouted)
GPIO_114_N9  (9 unrouted)
GPIO_115_N11  (3 unrouted)
GPIO_116_L16  (3 unrouted)
GPIO_117_K16  (3 unrouted)
GPIO_118_R16  (3 unrouted)
GPIO_119_L15  (3 unrouted)
GPIO_120_P15  (3 unrouted)
GPIO_121_P16  (3 unrouted)
GPIO_126_L14  (1 unrouted)
GPIO_128_M10  (1 unrouted)
GPIO_129_L13  (1 unrouted)
GPIO_130_J16  (1 unrouted)
GPIO_131_K15  (3 unrouted)
GPIO_132_J13  (3 unrouted)
N$9  (1 unrouted)
OUT21  (3 unrouted)
OUT22  (3 unrouted)
OUT23  (3 unrouted)
OUT24  (3 unrouted)
OUT29  (3 unrouted)
OUT30  (3 unrouted)
OUT31  (3 unrouted)
OUT32  (3 unrouted)
OUT37  (3 unrouted)
OUT38  (3 unrouted)
OUT39  (3 unrouted)
OUT40  (3 unrouted)

### Text on the board
tPlace: N9 (Outputs Enabled) | J16 | M10 | GND | 3V3 | L13 | L14 | GND | 5V | R11 | F13 | T11 | N9(OE) | de0-nano board | OUT | OUT | OUT | OUT | IN | IN | IN | IN | DIFF I/O PAIR | PV16 IN | OUT | OUT | OUT | OUT | IN | IN | IN | IN | DIFF I/O PAIR | DIFF I/O PAIR | OUT | OUT | OUT | OUT | IN | IN | IN | IN | de0-nano_2x13 board | ALT CLOCK | LASER CLOCK LVDS | OUT | OUT | IN | IN | OUT | OUT | IN | IN | OUT | OUT | -V4 | -V2 | IN | IN | OUT | OUT | -V3 | IN | IN | de0-nano VME expander, v1.41 / by Dr. Andy Haas